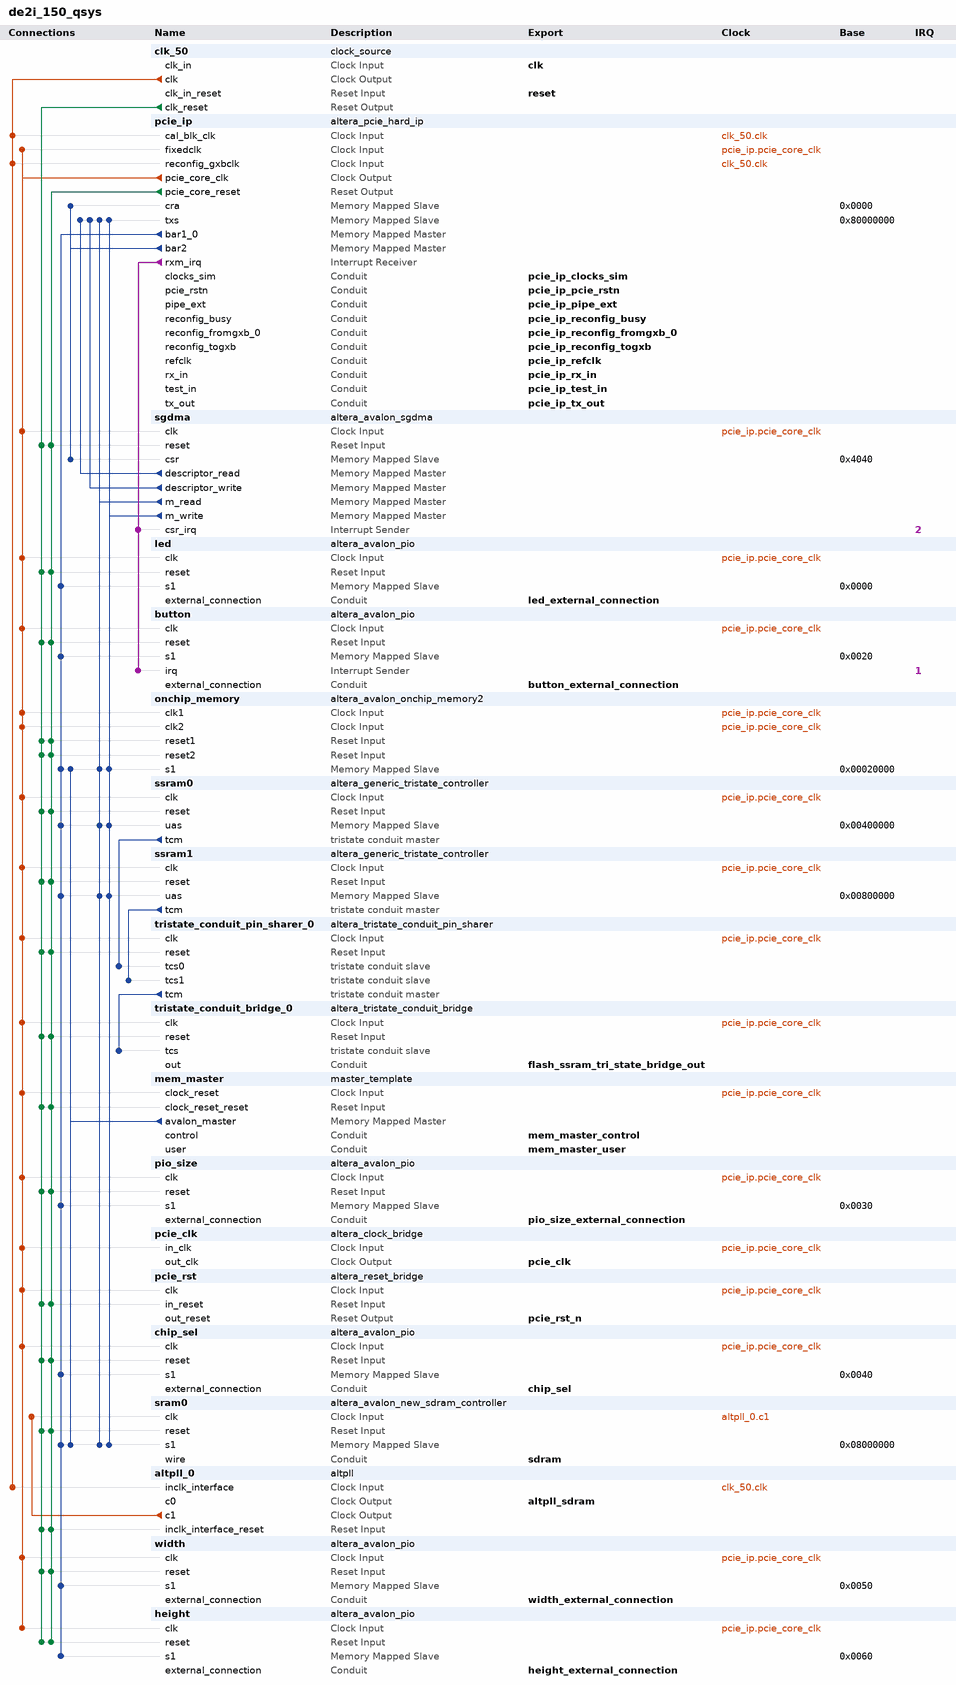
[diagram p0: system contents]
# Platform Designer (Qsys) system de2i_150_qsys, Cyclone IV GX EP4CGX150DF31C7
# Parameters at their usual value, and those the tool derives, are not listed.
package require -exact qsys 15.1
create_system de2i_150_qsys
set_project_property DEVICE_FAMILY {Cyclone IV GX}
set_project_property DEVICE EP4CGX150DF31C7

add_instance clk_50 clock_source 15.1
set_instance_parameter_value clk_50 clockFrequency 50000000

add_instance pcie_ip altera_pcie_hard_ip 15.1
set_instance_parameter_value pcie_ip {BAR Type} {64 bit Prefetchable,Not used,32 bit Non-Prefetchable,Not used,Not used,Not used}
set_instance_parameter_value pcie_ip CB_A2P_ADDR_MAP_PASS_THRU_BITS 31
set_instance_parameter_value pcie_ip CG_ENABLE_A2P_INTERRUPT 0
set_instance_parameter_value pcie_ip CG_NO_CPL_REORDERING 0
set_instance_parameter_value pcie_ip {PCIe Address 31:0} 0x00000000,0x00000000,0x00000000,0x00000000,0x00000000,0x00000000,0x00000000,0x00000000,0x00000000,0x00000000,0x00000000,0x00000000,0x00000000,0x00000000,0x00000000,0x00000000
set_instance_parameter_value pcie_ip {PCIe Address 63:32} 0x00000000,0x00000000,0x00000000,0x00000000,0x00000000,0x00000000,0x00000000,0x00000000,0x00000000,0x00000000,0x00000000,0x00000000,0x00000000,0x00000000,0x00000000,0x00000000
set_instance_parameter_value pcie_ip class_code 0
set_instance_parameter_value pcie_ip device_id 57345
set_instance_parameter_value pcie_ip my_advanced_errors false
set_instance_parameter_value pcie_ip my_enable_ecrc_check false
set_instance_parameter_value pcie_ip my_enable_ecrc_gen false
set_instance_parameter_value pcie_ip p_pcie_test_out_width None
set_instance_parameter_value pcie_ip p_user_msi_enable 0
set_instance_parameter_value pcie_ip subsystem_device_id 4
set_instance_parameter_value pcie_ip subsystem_vendor_id 4466
set_instance_parameter_value pcie_ip vendor_id 4466

add_instance sgdma altera_avalon_sgdma 15.1
set_instance_parameter_value sgdma enableBurstTransfers false
set_instance_parameter_value sgdma enableUnalignedTransfers false
set_instance_parameter_value sgdma readBlockDataWidth 64
set_instance_parameter_value sgdma sinkErrorWidth 0
set_instance_parameter_value sgdma sourceErrorWidth 0
set_instance_parameter_value sgdma transferMode MEMORY_TO_MEMORY
set_instance_parameter_value sgdma writeBurstcountWidth 4

add_instance led altera_avalon_pio 15.1
set_instance_parameter_value led direction Output
set_instance_parameter_value led width 4

add_instance button altera_avalon_pio 15.1
set_instance_parameter_value button captureEdge true
set_instance_parameter_value button direction Input
set_instance_parameter_value button edgeType FALLING
set_instance_parameter_value button generateIRQ true
set_instance_parameter_value button irqType EDGE
set_instance_parameter_value button width 4

add_instance onchip_memory altera_avalon_onchip_memory2 15.1
set_instance_parameter_value onchip_memory dataWidth 64
set_instance_parameter_value onchip_memory dualPort true
set_instance_parameter_value onchip_memory initMemContent true
set_instance_parameter_value onchip_memory initializationFileName onchip_memory
set_instance_parameter_value onchip_memory memorySize 131072

add_instance ssram0 altera_generic_tristate_controller 15.1
set_instance_parameter_value ssram0 ACTIVE_LOW_BEGINTRANSFER 1
set_instance_parameter_value ssram0 ACTIVE_LOW_BYTEENABLE 1
set_instance_parameter_value ssram0 ACTIVE_LOW_OUTPUTENABLE 1
set_instance_parameter_value ssram0 ACTIVE_LOW_READ 0
set_instance_parameter_value ssram0 CHIPSELECT_THROUGH_READLATENCY 1
set_instance_parameter_value ssram0 INTERFACE_ASSIGNMENT_KEYS embeddedsw.configuration.isMemoryDevice
set_instance_parameter_value ssram0 INTERFACE_ASSIGNMENT_VALUES 1
set_instance_parameter_value ssram0 MODULE_ASSIGNMENT_KEYS embeddedsw.configuration.hwClassnameDriverSupportList,embeddedsw.CMacro.SRAM_MEMORY_SIZE,embeddedsw.CMacro.SRAM_MEMORY_UNITS,embeddedsw.CMacro.SSRAM_DATA_WIDTH,embeddedsw.CMacro.SSRAM_READ_LATENCY,embeddedsw.memoryInfo.MEM_INIT_DATA_WIDTH,embeddedsw.memoryInfo.HAS_BYTE_LANE,embeddedsw.memoryInfo.GENERATE_DAT_SYM,embeddedsw.memoryInfo.DAT_SYM_INSTALL_DIR
set_instance_parameter_value ssram0 MODULE_ASSIGNMENT_VALUES altera_avalon_lan91c111:altera_avalon_cfi_flash,2,4194304,32,2,32,1,1,SIM_DIR
set_instance_parameter_value ssram0 TCM_ADDRESS_W 22
set_instance_parameter_value ssram0 TCM_BYTEENABLE_W 4
set_instance_parameter_value ssram0 TCM_DATA_HOLD 0
set_instance_parameter_value ssram0 TCM_DATA_W 32
set_instance_parameter_value ssram0 TCM_MAX_PENDING_READ_TRANSACTIONS 5
set_instance_parameter_value ssram0 TCM_READLATENCY 4
set_instance_parameter_value ssram0 TCM_READ_WAIT 0
set_instance_parameter_value ssram0 TCM_SETUP_WAIT 0
set_instance_parameter_value ssram0 TCM_SYMBOLS_PER_WORD 4
set_instance_parameter_value ssram0 TCM_TIMING_UNITS 1
set_instance_parameter_value ssram0 TCM_TURNAROUND_TIME 2
set_instance_parameter_value ssram0 TCM_WRITE_WAIT 0
set_instance_parameter_value ssram0 USE_BEGINTRANSFER 1
set_instance_parameter_value ssram0 USE_BYTEENABLE 1
set_instance_parameter_value ssram0 USE_OUTPUTENABLE 1
set_instance_parameter_value ssram0 USE_READ 0

add_instance ssram1 altera_generic_tristate_controller 15.1
set_instance_parameter_value ssram1 ACTIVE_LOW_BEGINTRANSFER 1
set_instance_parameter_value ssram1 ACTIVE_LOW_BYTEENABLE 1
set_instance_parameter_value ssram1 ACTIVE_LOW_OUTPUTENABLE 1
set_instance_parameter_value ssram1 ACTIVE_LOW_READ 0
set_instance_parameter_value ssram1 CHIPSELECT_THROUGH_READLATENCY 1
set_instance_parameter_value ssram1 INTERFACE_ASSIGNMENT_KEYS embeddedsw.configuration.isMemoryDevice
set_instance_parameter_value ssram1 INTERFACE_ASSIGNMENT_VALUES 1
set_instance_parameter_value ssram1 MODULE_ASSIGNMENT_KEYS embeddedsw.configuration.hwClassnameDriverSupportList,embeddedsw.CMacro.SRAM_MEMORY_SIZE,embeddedsw.CMacro.SRAM_MEMORY_UNITS,embeddedsw.CMacro.SSRAM_DATA_WIDTH,embeddedsw.CMacro.SSRAM_READ_LATENCY,embeddedsw.memoryInfo.MEM_INIT_DATA_WIDTH,embeddedsw.memoryInfo.HAS_BYTE_LANE,embeddedsw.memoryInfo.GENERATE_DAT_SYM,embeddedsw.memoryInfo.DAT_SYM_INSTALL_DIR
set_instance_parameter_value ssram1 MODULE_ASSIGNMENT_VALUES altera_avalon_lan91c111:altera_avalon_cfi_flash,2,4194304,32,2,32,1,1,SIM_DIR
set_instance_parameter_value ssram1 TCM_ADDRESS_W 22
set_instance_parameter_value ssram1 TCM_BYTEENABLE_W 4
set_instance_parameter_value ssram1 TCM_DATA_HOLD 0
set_instance_parameter_value ssram1 TCM_DATA_W 32
set_instance_parameter_value ssram1 TCM_MAX_PENDING_READ_TRANSACTIONS 5
set_instance_parameter_value ssram1 TCM_READLATENCY 4
set_instance_parameter_value ssram1 TCM_READ_WAIT 0
set_instance_parameter_value ssram1 TCM_SETUP_WAIT 0
set_instance_parameter_value ssram1 TCM_SYMBOLS_PER_WORD 4
set_instance_parameter_value ssram1 TCM_TIMING_UNITS 1
set_instance_parameter_value ssram1 TCM_TURNAROUND_TIME 2
set_instance_parameter_value ssram1 TCM_WRITE_WAIT 0
set_instance_parameter_value ssram1 USE_BEGINTRANSFER 1
set_instance_parameter_value ssram1 USE_BYTEENABLE 1
set_instance_parameter_value ssram1 USE_OUTPUTENABLE 1
set_instance_parameter_value ssram1 USE_READ 0

add_instance tristate_conduit_pin_sharer_0 altera_tristate_conduit_pin_sharer 15.1
set_instance_parameter_value tristate_conduit_pin_sharer_0 MODULE_ORIGIN_LIST ssram1.tcm,ssram1.tcm,ssram1.tcm,ssram1.tcm,ssram1.tcm,ssram1.tcm,ssram1.tcm,ssram0.tcm,ssram0.tcm,ssram0.tcm,ssram0.tcm,ssram0.tcm,ssram0.tcm,ssram0.tcm
set_instance_parameter_value tristate_conduit_pin_sharer_0 NUM_INTERFACES 2
set_instance_parameter_value tristate_conduit_pin_sharer_0 SHARED_SIGNAL_LIST fs_addr,ssram_be_n,ssram_oe_n,ssram_adsc_n,ssram_we_n,fs_data,ssram1_cs_n,fs_addr,ssram_be_n,ssram_oe_n,ssram_adsc_n,ssram_we_n,fs_data,ssram0_cs_n
set_instance_parameter_value tristate_conduit_pin_sharer_0 SIGNAL_ORIGIN_LIST address,byteenable_n,outputenable_n,begintransfer_n,write_n,data,chipselect_n,address,byteenable_n,outputenable_n,begintransfer_n,write_n,data,chipselect_n

add_instance tristate_conduit_bridge_0 altera_tristate_conduit_bridge 15.1

add_instance mem_master master_template 1.0
set_instance_parameter_value mem_master ADDRESS_WIDTH 32
set_instance_parameter_value mem_master BURST_CAPABLE 1
set_instance_parameter_value mem_master DATA_WIDTH 32
set_instance_parameter_value mem_master FIFO_DEPTH 256
set_instance_parameter_value mem_master MASTER_DIRECTION 0
set_instance_parameter_value mem_master MAXIMUM_BURST_COUNT 128
set_instance_parameter_value mem_master MEMORY_BASED_FIFO 1

add_instance pio_size altera_avalon_pio 15.1
set_instance_parameter_value pio_size direction Output
set_instance_parameter_value pio_size width 32

add_instance pcie_clk altera_clock_bridge 15.1
set_instance_parameter_value pcie_clk DERIVED_CLOCK_RATE 125000000
set_instance_parameter_value pcie_clk EXPLICIT_CLOCK_RATE 0

add_instance pcie_rst altera_reset_bridge 15.1
set_instance_parameter_value pcie_rst ACTIVE_LOW_RESET 1
set_instance_parameter_value pcie_rst SYNCHRONOUS_EDGES deassert

add_instance chip_sel altera_avalon_pio 15.1
set_instance_parameter_value chip_sel direction Output
set_instance_parameter_value chip_sel width 1

add_instance sram0 altera_avalon_new_sdram_controller 15.1
set_instance_parameter_value sram0 TAC 5.5
set_instance_parameter_value sram0 TRCD 20.0
set_instance_parameter_value sram0 TRP 20.0
set_instance_parameter_value sram0 casLatency 3
set_instance_parameter_value sram0 columnWidth 10
set_instance_parameter_value sram0 dataWidth 32
set_instance_parameter_value sram0 generateSimulationModel false
set_instance_parameter_value sram0 model single_Micron_MT48LC4M32B2_7_chip
set_instance_parameter_value sram0 numberOfBanks 4
set_instance_parameter_value sram0 numberOfChipSelects 1
set_instance_parameter_value sram0 powerUpDelay 100.0
set_instance_parameter_value sram0 refreshPeriod 15.625
set_instance_parameter_value sram0 rowWidth 13

add_instance altpll_0 altpll 15.1
set_instance_parameter_value altpll_0 CLK0_DIVIDE_BY 1
set_instance_parameter_value altpll_0 CLK0_MULTIPLY_BY 3
set_instance_parameter_value altpll_0 CLK0_PHASE_SHIFT -1852
set_instance_parameter_value altpll_0 CLK1_DIVIDE_BY 1
set_instance_parameter_value altpll_0 CLK1_DUTY_CYCLE 50
set_instance_parameter_value altpll_0 CLK1_MULTIPLY_BY 3
set_instance_parameter_value altpll_0 CLK1_PHASE_SHIFT 0
set_instance_parameter_value altpll_0 INCLK0_INPUT_FREQUENCY 20000
set_instance_parameter_value altpll_0 PORT_ARESET PORT_USED
set_instance_parameter_value altpll_0 PORT_LOCKED PORT_USED
set_instance_parameter_value altpll_0 PORT_clk1 PORT_USED
set_instance_parameter_value altpll_0 PORT_clk2 PORT_UNUSED
set_instance_parameter_value altpll_0 PORT_clk3 PORT_UNUSED

add_instance width altera_avalon_pio 15.1
set_instance_parameter_value width direction Input
set_instance_parameter_value width edgeType ANY
set_instance_parameter_value width width 32

add_instance height altera_avalon_pio 15.1
set_instance_parameter_value height direction Input
set_instance_parameter_value height edgeType ANY
set_instance_parameter_value height width 32

# connections
add_connection altpll_0.c1 sram0.clk clock
add_connection clk_50.clk altpll_0.inclk_interface clock
add_connection clk_50.clk pcie_ip.cal_blk_clk clock
add_connection clk_50.clk pcie_ip.reconfig_gxbclk clock
add_connection pcie_ip.pcie_core_clk button.clk clock
add_connection pcie_ip.pcie_core_clk chip_sel.clk clock
add_connection pcie_ip.pcie_core_clk height.clk clock
add_connection pcie_ip.pcie_core_clk led.clk clock
add_connection pcie_ip.pcie_core_clk mem_master.clock_reset clock
add_connection pcie_ip.pcie_core_clk onchip_memory.clk1 clock
add_connection pcie_ip.pcie_core_clk onchip_memory.clk2 clock
add_connection pcie_ip.pcie_core_clk pcie_clk.in_clk clock
add_connection pcie_ip.pcie_core_clk pcie_ip.fixedclk clock
add_connection pcie_ip.pcie_core_clk pcie_rst.clk clock
add_connection pcie_ip.pcie_core_clk pio_size.clk clock
add_connection pcie_ip.pcie_core_clk sgdma.clk clock
add_connection pcie_ip.pcie_core_clk ssram0.clk clock
add_connection pcie_ip.pcie_core_clk ssram1.clk clock
add_connection pcie_ip.pcie_core_clk tristate_conduit_bridge_0.clk clock
add_connection pcie_ip.pcie_core_clk tristate_conduit_pin_sharer_0.clk clock
add_connection pcie_ip.pcie_core_clk width.clk clock
add_connection clk_50.clk_reset altpll_0.inclk_interface_reset reset
add_connection clk_50.clk_reset button.reset reset
add_connection clk_50.clk_reset chip_sel.reset reset
add_connection clk_50.clk_reset height.reset reset
add_connection clk_50.clk_reset led.reset reset
add_connection clk_50.clk_reset mem_master.clock_reset_reset reset
add_connection clk_50.clk_reset onchip_memory.reset1 reset
add_connection clk_50.clk_reset onchip_memory.reset2 reset
add_connection clk_50.clk_reset pcie_rst.in_reset reset
add_connection clk_50.clk_reset pio_size.reset reset
add_connection clk_50.clk_reset sgdma.reset reset
add_connection clk_50.clk_reset sram0.reset reset
add_connection clk_50.clk_reset ssram0.reset reset
add_connection clk_50.clk_reset ssram1.reset reset
add_connection clk_50.clk_reset tristate_conduit_bridge_0.reset reset
add_connection clk_50.clk_reset tristate_conduit_pin_sharer_0.reset reset
add_connection clk_50.clk_reset width.reset reset
add_connection pcie_ip.pcie_core_reset altpll_0.inclk_interface_reset reset
add_connection pcie_ip.pcie_core_reset button.reset reset
add_connection pcie_ip.pcie_core_reset chip_sel.reset reset
add_connection pcie_ip.pcie_core_reset height.reset reset
add_connection pcie_ip.pcie_core_reset led.reset reset
add_connection pcie_ip.pcie_core_reset mem_master.clock_reset_reset reset
add_connection pcie_ip.pcie_core_reset onchip_memory.reset1 reset
add_connection pcie_ip.pcie_core_reset onchip_memory.reset2 reset
add_connection pcie_ip.pcie_core_reset pcie_rst.in_reset reset
add_connection pcie_ip.pcie_core_reset pio_size.reset reset
add_connection pcie_ip.pcie_core_reset sgdma.reset reset
add_connection pcie_ip.pcie_core_reset sram0.reset reset
add_connection pcie_ip.pcie_core_reset ssram0.reset reset
add_connection pcie_ip.pcie_core_reset ssram1.reset reset
add_connection pcie_ip.pcie_core_reset tristate_conduit_bridge_0.reset reset
add_connection pcie_ip.pcie_core_reset tristate_conduit_pin_sharer_0.reset reset
add_connection pcie_ip.pcie_core_reset width.reset reset
add_connection mem_master.avalon_master onchip_memory.s1 avalon
set_connection_parameter_value mem_master.avalon_master/onchip_memory.s1 baseAddress 0x00020000
add_connection mem_master.avalon_master sram0.s1 avalon
set_connection_parameter_value mem_master.avalon_master/sram0.s1 baseAddress 0x08000000
add_connection pcie_ip.bar1_0 button.s1 avalon
set_connection_parameter_value pcie_ip.bar1_0/button.s1 baseAddress 0x0020
add_connection pcie_ip.bar1_0 chip_sel.s1 avalon
set_connection_parameter_value pcie_ip.bar1_0/chip_sel.s1 baseAddress 0x0040
add_connection pcie_ip.bar1_0 height.s1 avalon
set_connection_parameter_value pcie_ip.bar1_0/height.s1 baseAddress 0x0060
add_connection pcie_ip.bar1_0 led.s1 avalon
set_connection_parameter_value pcie_ip.bar1_0/led.s1 baseAddress 0x0000
add_connection pcie_ip.bar1_0 onchip_memory.s1 avalon
set_connection_parameter_value pcie_ip.bar1_0/onchip_memory.s1 baseAddress 0x00020000
add_connection pcie_ip.bar1_0 pio_size.s1 avalon
set_connection_parameter_value pcie_ip.bar1_0/pio_size.s1 baseAddress 0x0030
add_connection pcie_ip.bar1_0 sram0.s1 avalon
set_connection_parameter_value pcie_ip.bar1_0/sram0.s1 baseAddress 0x08000000
add_connection pcie_ip.bar1_0 ssram0.uas avalon
set_connection_parameter_value pcie_ip.bar1_0/ssram0.uas baseAddress 0x00400000
add_connection pcie_ip.bar1_0 ssram1.uas avalon
set_connection_parameter_value pcie_ip.bar1_0/ssram1.uas baseAddress 0x00800000
add_connection pcie_ip.bar1_0 width.s1 avalon
set_connection_parameter_value pcie_ip.bar1_0/width.s1 baseAddress 0x0050
add_connection pcie_ip.bar2 pcie_ip.cra avalon
set_connection_parameter_value pcie_ip.bar2/pcie_ip.cra baseAddress 0x0000
add_connection pcie_ip.bar2 sgdma.csr avalon
set_connection_parameter_value pcie_ip.bar2/sgdma.csr baseAddress 0x4040
add_connection sgdma.descriptor_read pcie_ip.txs avalon
set_connection_parameter_value sgdma.descriptor_read/pcie_ip.txs baseAddress 0x80000000
add_connection sgdma.descriptor_write pcie_ip.txs avalon
set_connection_parameter_value sgdma.descriptor_write/pcie_ip.txs baseAddress 0x80000000
add_connection sgdma.m_read onchip_memory.s1 avalon
set_connection_parameter_value sgdma.m_read/onchip_memory.s1 baseAddress 0x00020000
add_connection sgdma.m_read pcie_ip.txs avalon
set_connection_parameter_value sgdma.m_read/pcie_ip.txs baseAddress 0x80000000
add_connection sgdma.m_read sram0.s1 avalon
set_connection_parameter_value sgdma.m_read/sram0.s1 baseAddress 0x08000000
add_connection sgdma.m_read ssram0.uas avalon
set_connection_parameter_value sgdma.m_read/ssram0.uas baseAddress 0x00400000
add_connection sgdma.m_read ssram1.uas avalon
set_connection_parameter_value sgdma.m_read/ssram1.uas baseAddress 0x00800000
add_connection sgdma.m_write onchip_memory.s1 avalon
set_connection_parameter_value sgdma.m_write/onchip_memory.s1 baseAddress 0x00020000
add_connection sgdma.m_write pcie_ip.txs avalon
set_connection_parameter_value sgdma.m_write/pcie_ip.txs baseAddress 0x80000000
add_connection sgdma.m_write sram0.s1 avalon
set_connection_parameter_value sgdma.m_write/sram0.s1 baseAddress 0x08000000
add_connection sgdma.m_write ssram0.uas avalon
set_connection_parameter_value sgdma.m_write/ssram0.uas baseAddress 0x00400000
add_connection sgdma.m_write ssram1.uas avalon
set_connection_parameter_value sgdma.m_write/ssram1.uas baseAddress 0x00800000
add_connection pcie_ip.rxm_irq button.irq interrupt
set_connection_parameter_value pcie_ip.rxm_irq/button.irq irqNumber 1
add_connection pcie_ip.rxm_irq sgdma.csr_irq interrupt
set_connection_parameter_value pcie_ip.rxm_irq/sgdma.csr_irq irqNumber 2
add_connection ssram0.tcm tristate_conduit_pin_sharer_0.tcs0 tristate_conduit
add_connection ssram1.tcm tristate_conduit_pin_sharer_0.tcs1 tristate_conduit
add_connection tristate_conduit_pin_sharer_0.tcm tristate_conduit_bridge_0.tcs tristate_conduit

# exported interfaces
add_interface altpll_sdram clock source
set_interface_property altpll_sdram EXPORT_OF altpll_0.c0
add_interface button_external_connection conduit end
set_interface_property button_external_connection EXPORT_OF button.external_connection
add_interface chip_sel conduit end
set_interface_property chip_sel EXPORT_OF chip_sel.external_connection
add_interface clk clock sink
set_interface_property clk EXPORT_OF clk_50.clk_in
add_interface flash_ssram_tri_state_bridge_out conduit end
set_interface_property flash_ssram_tri_state_bridge_out EXPORT_OF tristate_conduit_bridge_0.out
add_interface height_external_connection conduit end
set_interface_property height_external_connection EXPORT_OF height.external_connection
add_interface led_external_connection conduit end
set_interface_property led_external_connection EXPORT_OF led.external_connection
add_interface mem_master_control conduit end
set_interface_property mem_master_control EXPORT_OF mem_master.control
add_interface mem_master_user conduit end
set_interface_property mem_master_user EXPORT_OF mem_master.user
add_interface pcie_clk clock source
set_interface_property pcie_clk EXPORT_OF pcie_clk.out_clk
add_interface pcie_ip_clocks_sim conduit end
set_interface_property pcie_ip_clocks_sim EXPORT_OF pcie_ip.clocks_sim
add_interface pcie_ip_pcie_rstn conduit end
set_interface_property pcie_ip_pcie_rstn EXPORT_OF pcie_ip.pcie_rstn
add_interface pcie_ip_pipe_ext conduit end
set_interface_property pcie_ip_pipe_ext EXPORT_OF pcie_ip.pipe_ext
add_interface pcie_ip_reconfig_busy conduit end
set_interface_property pcie_ip_reconfig_busy EXPORT_OF pcie_ip.reconfig_busy
add_interface pcie_ip_reconfig_fromgxb_0 conduit end
set_interface_property pcie_ip_reconfig_fromgxb_0 EXPORT_OF pcie_ip.reconfig_fromgxb_0
add_interface pcie_ip_reconfig_togxb conduit end
set_interface_property pcie_ip_reconfig_togxb EXPORT_OF pcie_ip.reconfig_togxb
add_interface pcie_ip_refclk conduit end
set_interface_property pcie_ip_refclk EXPORT_OF pcie_ip.refclk
add_interface pcie_ip_rx_in conduit end
set_interface_property pcie_ip_rx_in EXPORT_OF pcie_ip.rx_in
add_interface pcie_ip_test_in conduit end
set_interface_property pcie_ip_test_in EXPORT_OF pcie_ip.test_in
add_interface pcie_ip_tx_out conduit end
set_interface_property pcie_ip_tx_out EXPORT_OF pcie_ip.tx_out
add_interface pcie_rst_n reset source
set_interface_property pcie_rst_n EXPORT_OF pcie_rst.out_reset
add_interface pio_size_external_connection conduit end
set_interface_property pio_size_external_connection EXPORT_OF pio_size.external_connection
add_interface reset reset sink
set_interface_property reset EXPORT_OF clk_50.clk_in_reset
add_interface sdram conduit end
set_interface_property sdram EXPORT_OF sram0.wire
add_interface width_external_connection conduit end
set_interface_property width_external_connection EXPORT_OF width.external_connection

set_interconnect_requirement {$system} qsys_mm.clockCrossingAdapter HANDSHAKE
set_interconnect_requirement {$system} qsys_mm.maxAdditionalLatency 1

save_system de2i_150_qsys.qsys
